# Altium project PCB_Project multi sheet.PrjPcb
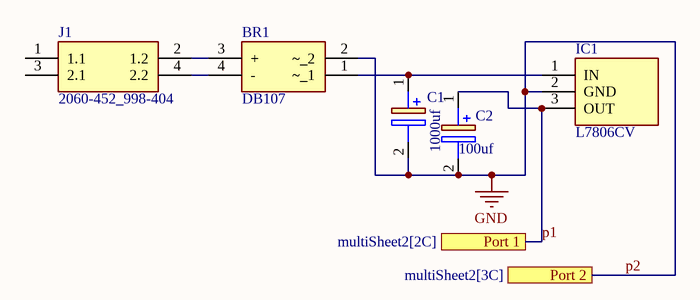
[diagram p0: multiSheet1.SchDoc]
2 sheets, 8 parts. Net scope: flat (ports and power ports of the same name join across sheets).
Board file: multisheet PCB1.PcbDoc
Sheets:
  multiSheet1.SchDoc
  multiSheet2.SchDoc

## Sheet multiSheet1.SchDoc
size A4; SheetNumber: 1; SheetTotal: 2

### Parts
BR1  DB107  [DIP825W50P510L830H340Q4N]
C1  1000uf  [CAPPRD550W60D1050H2150]
C2  100uf  [CAPPRD500W65D1000H3200]
IC1  L7806CV  [TO270P460X1020X2008-3P]
J1  2060-452_998-404  [2060452998404]

### Ports
Port 1 (see multiSheet2[2C]), Port 2 (see multiSheet2[3C])

### Nets
p2: BR1.2(~_2) C1.2(-) C2.2(-) IC1.2(GND) ; port Port 2  [also labelled GND]
p1: C2.1(+) IC1.3(OUT) ; port Port 1
NetBR1_1: BR1.1(~_1) C1.1(+) IC1.1(IN)
NetBR1_3: BR1.3(+) J1.2(1.2)
NetBR1_4: BR1.4(-) J1.4(2.2)

Not connected (* = marked no-connect by the designer): J1 1(1.1) 3(2.1)

### Library data of the parts
BR1 = DB107: Bridge Rectifier; Manufacturer_Name: Rectron; Datasheet Link: https://www.rectron.com/data_sheets/db101-107.pdf; Height: 3.4mm; Manufacturer_Part_Number: DB107; Mouser Part Number: 583-DB107; Mouser Price/Stock: https://www.mouser.co.uk/ProductDetail/Rectron/DB107?qs=G5AQjGfRJcLGAY%252B6bEDnbw%3D%3D
C1 = 108CKE025M: Capacitor Polarised; Manufacturer_Name: Cinch Connectivity Solutions; Datasheet Link: https://componentsearchengine.com/Datasheets/2/108CKE025M.pdf; Height: 21.5mm; Manufacturer_Part_Number: 108CKE025M
C2 = EEU-FC2A101L: Capacitor Polarised; Manufacturer_Name: Panasonic; Datasheet Link: http://industrial.panasonic.com/cdbs/www-data/pdf/RDF0000/ABA0000C1209.pdf; Height: 32mm; Manufacturer_Part_Number: EEU-FC2A101L; Mouser Part Number: 667-EEU-FC2A101L; Mouser Price/Stock: https://www.mouser.co.uk/ProductDetail/Panasonic/EEU-FC2A101L?qs=MtOUKumLmnYYrYsMGpDvcw%3D%3D; Arrow Part Number: EEU-FC2A101L; Arrow Price/Stock: https://www.arrow.com/en/products/eeu-fc2a101l/panasonic?region=nac
IC1 = L7806CV: Integrated Circuit; Manufacturer_Name: STMicroelectronics; Datasheet Link: http://www.st.com/web/en/resource/technical/document/datasheet/CD00000444.pdf; Height: 4.6mm; Manufacturer_Part_Number: L7806CV; Mouser Part Number: 511-L7806CV; Mouser Price/Stock: https://www.mouser.co.uk/ProductDetail/STMicroelectronics/L7806CV?qs=K4DpzJ20gDEC%252BHE13eVUwg%3D%3D; Arrow Part Number: L7806CV; Arrow Price/Stock: https://www.arrow.com/en/products/l7806cv/stmicroelectronics?region=europe
J1 = 2060-452_998-404: Connector; Manufacturer_Name: Wago; Manufacturer_Part_Number: 2060-452/998-404; Datasheet Link: https://www.wago.com/2060-452/998-404; Height: 4.5mm; Arrow Part Number: 2060-452/998-404; Arrow Price/Stock: https://www.arrow.com/en/products/2060-452998-404/wago-kontakttechnik-gmbh?region=nac

## Sheet multiSheet2.SchDoc
size A4; SheetNumber: 2; SheetTotal: 2
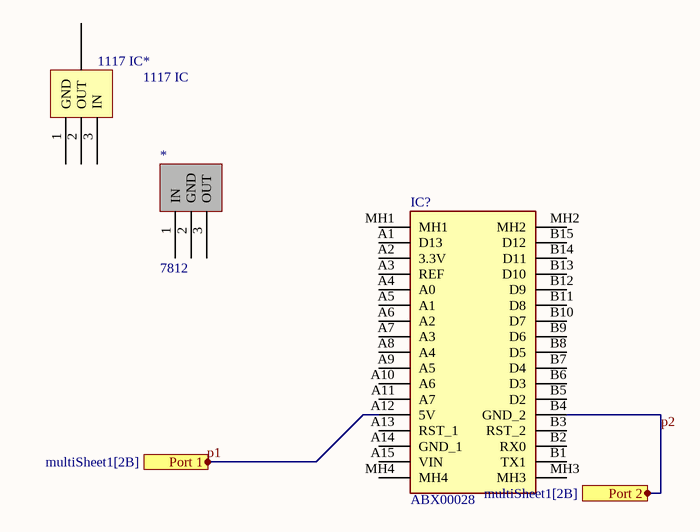
[diagram p1: multiSheet2.SchDoc]

### Parts
(Parts that share a designator on the sheet are numbered #1, #2 ... from top to bottom, then left to right.)
*#1  1117 IC  [1117 ic]
*#2  7812  [7812]
IC?  ABX00028  [ABX00028]

### Ports
Port 1 (see multiSheet1[2B]), Port 2 (see multiSheet1[2B])

### Nets
p2: IC?.B4(GND_2) ; port Port 2
p1: IC?.A12(5V) ; port Port 1

Not connected (* = marked no-connect by the designer): *#1 1(GND) 2(OUT) 3(IN) ?1; *#2 1(IN) 2(GND) 3(OUT); IC? A1(D13) A2(3.3V) A3(REF) A4(A0) A5(A1) A6(A2) A7(A3) A8(A4) A9(A5) A10(A6) A11(A7) A13(RST_1) A14(GND_1) A15(VIN) B1(TX1) B2(RX0) B3(RST_2) B5(D2) B6(D3) B7(D4) B8(D5) B9(D6) B10(D7) B11(D8) B12(D9) B13(D10) B14(D11) B15(D12) MH1 MH2 MH3 MH4

### Library data of the parts
IC? = ABX00028: Integrated Circuit; Manufacturer_Name: Arduino; Datasheet Link: https://store.arduino.cc/arduino-nano-every; Height: 10mm; Manufacturer_Part_Number: ABX00028; Mouser Part Number: 782-ABX00028; Mouser Price/Stock: https://www.mouser.co.uk/ProductDetail/Arduino/ABX00028?qs=PzGy0jfpSMtit6rnFl8mVg%3D%3D; Arrow Part Number: ABX00028; Arrow Price/Stock: https://www.arrow.com/en/products/abx00028/arduino-corporation?region=nac

## Nets that join several sheets
p2: multiSheet1 (BR1.2 C1.2 C2.2 IC1.2), multiSheet2 (IC?.B4)
p1: multiSheet1 (C2.1 IC1.3), multiSheet2 (IC?.A12)